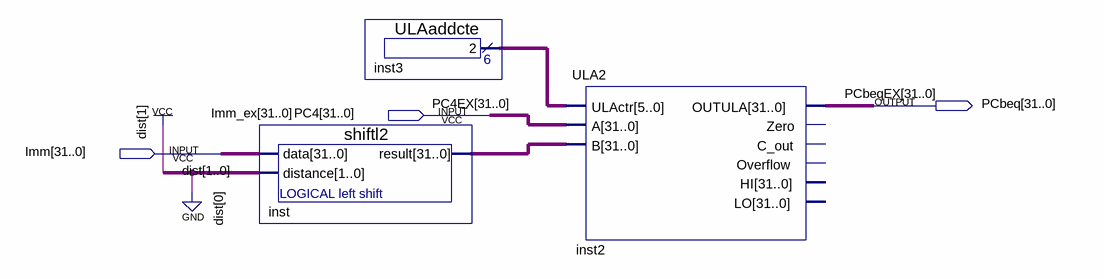
[diagram p0: schematic sheet]
// Quartus schematic CalcBEQ.bdf as structural Verilog: 3 symbols, 3 pins
module CalcBEQ (
  input  [31:0] PC4,
  input  [31:0] Imm,
  output [31:0] PCbeq
);

  wire [5:0] inst3_result;
  wire [31:0] inst_result;

  shiftl2 inst (.data(Imm), .distance(2'b10), .result(inst_result));
  ULAaddcte inst3 (.result(inst3_result));
  ULA2 inst2 (.ULActr(inst3_result), .A(PC4), .B(inst_result), .OUTULA(PCbeq));  // open: Zero, C_out, Overflow, HI, LO

  // Other names for the same wires on the sheet: Imm_ex[31:0] = Imm; PC4EX[31:0] = PC4; PCbeqEX[31:0] = PCbeq
endmodule
